# Altium schematic sheet Drawdio.SchDoc: Drawdio w/ OLED dispaly
size 297 x 209 mm; DocumentNumber: SP-0331; SheetNumber: 1; SheetTotal: 5
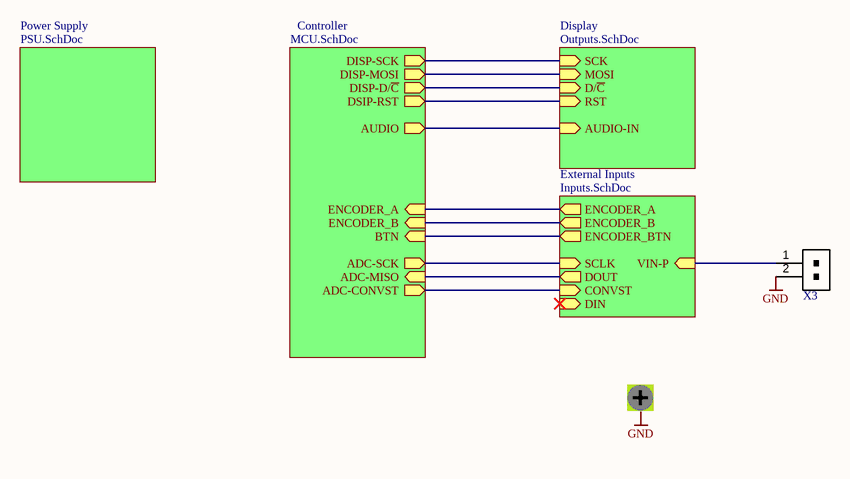
[diagram p0: Drawdio.SchDoc]

## Parts
MH1  MECH - M2 screw  [MECH-M2 - no screw]  (value not drawn)
X3  CONN - 2P -THT-JST 2.00mm  [CONN-2P-THT-RIGHT-JST 2.00mm]  (value not drawn)

## Sub-sheets
Controller = MCU.SchDoc: BTN (in), ENCODER_B (in), ENCODER_A (in), DISP-MOSI (out), DISP-SCK (out), DSIP-RST (out), DISP-D/~{C} (out), ADC-CONVST (out), ADC-SCK (out), ADC-MISO (in), AUDIO (out)
Display = Outputs.SchDoc: MOSI (in), RST (in), SCK (in), D/~{C} (in), AUDIO-IN (in)
External Inputs = Inputs.SchDoc: ENCODER_A (out), ENCODER_B (out), ENCODER_BTN (out), DIN (in), SCLK (in), DOUT (out), CONVST (in), VIN-P (in)
Power Supply = PSU.SchDoc: no entries

## Nets
GND: MH1.MH(Con) X3.2
NetX3_1: X3.1 ; sheet External Inputs/VIN-P
(unnamed): sheet Controller/BTN, sheet External Inputs/ENCODER_BTN
(unnamed): sheet Controller/ENCODER_B, sheet External Inputs/ENCODER_B
(unnamed): sheet Controller/ENCODER_A, sheet External Inputs/ENCODER_A
(unnamed): sheet Controller/DISP-MOSI, sheet Display/MOSI
(unnamed): sheet Controller/DISP-SCK, sheet Display/SCK
(unnamed): sheet Controller/DSIP-RST, sheet Display/RST
(unnamed): sheet Controller/DISP-D/~{C}, sheet Display/D/~{C}
(unnamed): sheet Controller/ADC-CONVST, sheet External Inputs/CONVST
(unnamed): sheet Controller/ADC-SCK, sheet External Inputs/SCLK
(unnamed): sheet Controller/ADC-MISO, sheet External Inputs/DOUT
(unnamed): sheet Controller/AUDIO, sheet Display/AUDIO-IN

## Notes on the sheet
- PROJECT NAME
- DATE
- TITLE
- TIME
- VERSION CONTROL
- N/A
- SIZE
- SCALE:
- A4
- FILE NAME
- DWG NO.
- SHEET
- REV
- OF
- DRAWN BY:

## Library data of the parts
MH1 = MECH - M2 screw: M3 hole with screw; Distributor: *; Order number: *
X3 = CONN - 2P -THT-JST 2.00mm: 1x2 pin THT connector; Order number: 100.385.23; 100.341.10; Distributor: Hestore